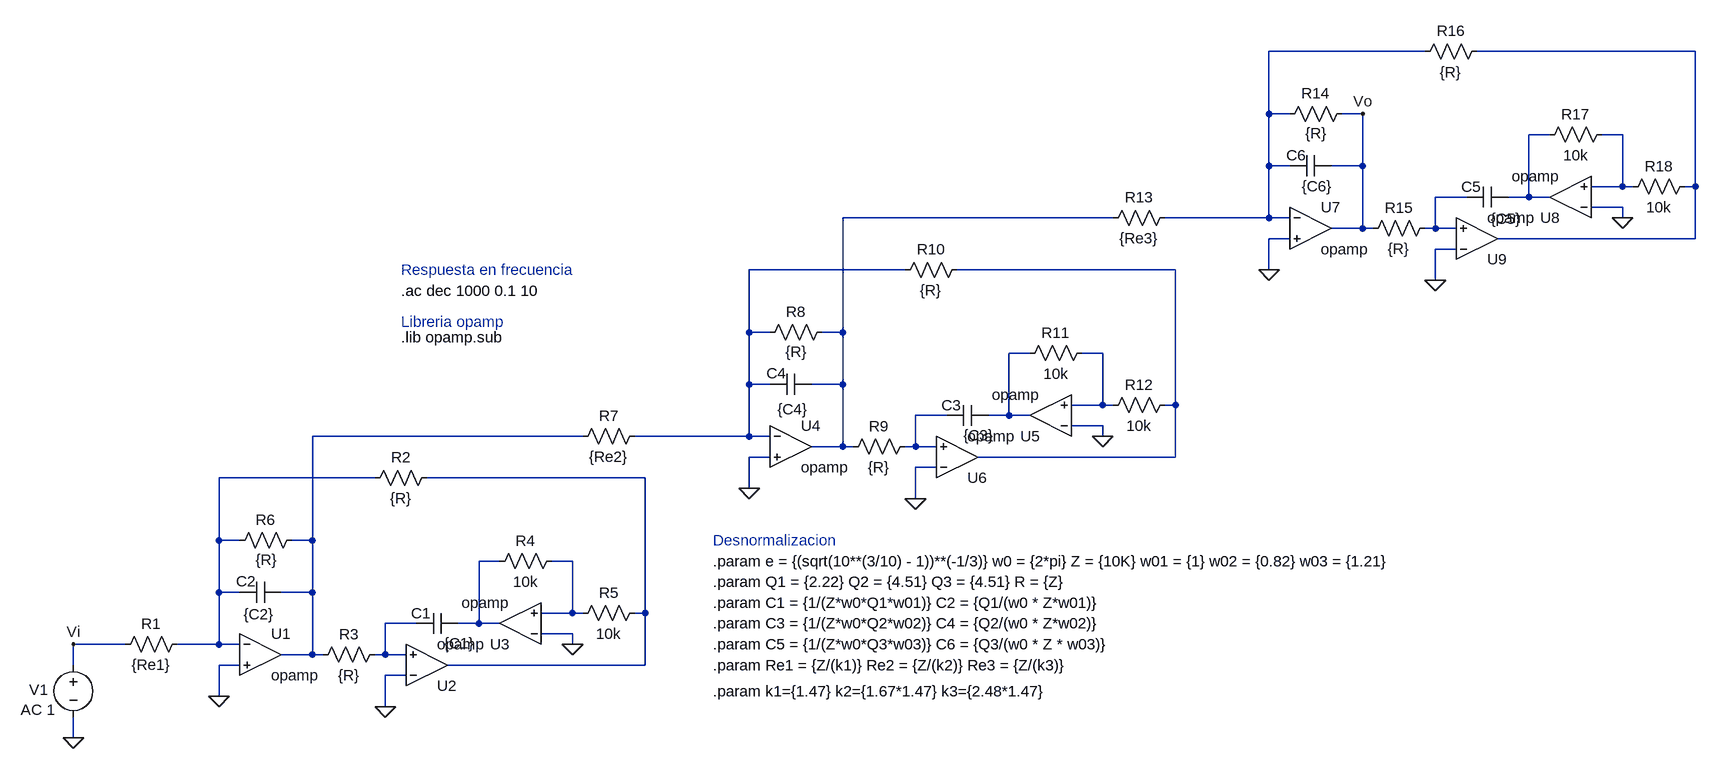
[diagram p0: schematic Circuito_Semana_4bis.asc]
Circuito_Semana_4bis.asc, the LTspice schematic file:
Version 4
SHEET 1 1816 680
WIRE 928 -1072 688 -1072
WIRE 1344 -1072 1008 -1072
WIRE 688 -976 688 -1072
WIRE 720 -976 688 -976
WIRE 832 -976 800 -976
WIRE 1120 -944 1088 -944
WIRE 1232 -944 1200 -944
WIRE 688 -896 688 -976
WIRE 720 -896 688 -896
WIRE 832 -896 832 -976
WIRE 832 -896 784 -896
WIRE 1232 -864 1232 -944
WIRE 1232 -864 1184 -864
WIRE 1248 -864 1232 -864
WIRE 1344 -864 1344 -1072
WIRE 1344 -864 1328 -864
WIRE 992 -848 944 -848
WIRE 1088 -848 1088 -944
WIRE 1088 -848 1056 -848
WIRE 1120 -848 1088 -848
WIRE 1232 -832 1184 -832
WIRE 448 -816 32 -816
WIRE 688 -816 688 -896
WIRE 688 -816 528 -816
WIRE 720 -816 688 -816
WIRE 1232 -816 1232 -832
WIRE 832 -800 832 -896
WIRE 832 -800 784 -800
WIRE 848 -800 832 -800
WIRE 944 -800 944 -848
WIRE 944 -800 928 -800
WIRE 976 -800 944 -800
WIRE 720 -784 688 -784
WIRE 1344 -784 1344 -864
WIRE 1344 -784 1040 -784
WIRE 976 -768 944 -768
WIRE 128 -736 -112 -736
WIRE 544 -736 208 -736
WIRE 688 -736 688 -784
WIRE 944 -720 944 -768
WIRE -112 -640 -112 -736
WIRE -80 -640 -112 -640
WIRE 32 -640 32 -816
WIRE 32 -640 0 -640
WIRE 320 -608 288 -608
WIRE 432 -608 400 -608
WIRE -112 -560 -112 -640
WIRE -80 -560 -112 -560
WIRE 32 -560 32 -640
WIRE 32 -560 -16 -560
WIRE 432 -528 432 -608
WIRE 432 -528 384 -528
WIRE 448 -528 432 -528
WIRE 544 -528 544 -736
WIRE 544 -528 528 -528
WIRE 192 -512 144 -512
WIRE 288 -512 288 -608
WIRE 288 -512 256 -512
WIRE 320 -512 288 -512
WIRE 432 -496 384 -496
WIRE -368 -480 -784 -480
WIRE -112 -480 -112 -560
WIRE -112 -480 -288 -480
WIRE -80 -480 -112 -480
WIRE 432 -480 432 -496
WIRE 32 -464 32 -560
WIRE 32 -464 -16 -464
WIRE 48 -464 32 -464
WIRE 144 -464 144 -512
WIRE 144 -464 128 -464
WIRE 176 -464 144 -464
WIRE -80 -448 -112 -448
WIRE 544 -448 544 -528
WIRE 544 -448 240 -448
WIRE 176 -432 144 -432
WIRE -688 -416 -928 -416
WIRE -272 -416 -608 -416
WIRE -112 -400 -112 -448
WIRE 144 -384 144 -432
WIRE -928 -320 -928 -416
WIRE -896 -320 -928 -320
WIRE -784 -320 -784 -480
WIRE -784 -320 -816 -320
WIRE -496 -288 -528 -288
WIRE -384 -288 -416 -288
WIRE -928 -240 -928 -320
WIRE -896 -240 -928 -240
WIRE -784 -240 -784 -320
WIRE -784 -240 -832 -240
WIRE -384 -208 -384 -288
WIRE -384 -208 -432 -208
WIRE -368 -208 -384 -208
WIRE -272 -208 -272 -416
WIRE -272 -208 -288 -208
WIRE -624 -192 -672 -192
WIRE -528 -192 -528 -288
WIRE -528 -192 -560 -192
WIRE -496 -192 -528 -192
WIRE -384 -176 -432 -176
WIRE -1072 -160 -1152 -160
WIRE -928 -160 -928 -240
WIRE -928 -160 -992 -160
WIRE -896 -160 -928 -160
WIRE -384 -160 -384 -176
WIRE -784 -144 -784 -240
WIRE -784 -144 -832 -144
WIRE -768 -144 -784 -144
WIRE -672 -144 -672 -192
WIRE -672 -144 -688 -144
WIRE -640 -144 -672 -144
WIRE -1152 -128 -1152 -160
WIRE -896 -128 -928 -128
WIRE -272 -128 -272 -208
WIRE -272 -128 -576 -128
WIRE -640 -112 -672 -112
WIRE -928 -80 -928 -128
WIRE -672 -64 -672 -112
WIRE -1152 -16 -1152 -48
FLAG -1152 -16 0
FLAG -1152 -160 Vi
FLAG -928 -80 0
FLAG -672 -64 0
FLAG -384 -160 0
FLAG -112 -400 0
FLAG 144 -384 0
FLAG 432 -480 0
FLAG 688 -736 0
FLAG 944 -720 0
FLAG 1232 -816 0
FLAG 832 -976 Vo
SYMBOL voltage -1152 -144 R0
WINDOW 3 24 44 Left 2
WINDOW 123 -81 85 Left 2
WINDOW 39 0 0 Left 0
WINDOW 0 -68 54 Left 2
SYMATTR Value ""
SYMATTR Value2 AC 1
SYMATTR InstName V1
SYMBOL OpAmps\\opamp -864 -208 R0
SYMATTR InstName U1
SYMBOL res -976 -176 R90
WINDOW 0 0 56 VBottom 2
WINDOW 3 32 56 VTop 2
SYMATTR InstName R1
SYMATTR Value {Re1}
SYMBOL cap -832 -256 R90
WINDOW 0 15 54 VBottom 2
WINDOW 3 34 34 VTop 2
SYMATTR InstName C2
SYMATTR Value {C2}
SYMBOL res -800 -336 R90
WINDOW 0 0 56 VBottom 2
WINDOW 3 30 55 VTop 2
SYMATTR InstName R6
SYMATTR Value {R}
SYMBOL res -592 -432 R90
WINDOW 0 0 56 VBottom 2
WINDOW 3 32 56 VTop 2
SYMATTR InstName R2
SYMATTR Value {R}
SYMBOL OpAmps\\opamp -464 -128 R180
SYMATTR InstName U3
SYMBOL OpAmps\\opamp -608 -64 M180
SYMATTR InstName U2
SYMBOL res -672 -160 R90
WINDOW 0 0 56 VBottom 2
WINDOW 3 32 56 VTop 2
SYMATTR InstName R3
SYMATTR Value {R}
SYMBOL cap -560 -208 R90
WINDOW 0 16 57 VBottom 2
WINDOW 3 31 -2 VTop 2
SYMATTR InstName C1
SYMATTR Value {C1}
SYMBOL res -400 -304 R90
WINDOW 0 0 56 VBottom 2
WINDOW 3 32 56 VTop 2
SYMATTR InstName R4
SYMATTR Value 10k
SYMBOL res -272 -224 R90
WINDOW 0 0 56 VBottom 2
WINDOW 3 32 56 VTop 2
SYMATTR InstName R5
SYMATTR Value 10k
SYMBOL OpAmps\\opamp -48 -528 R0
SYMATTR InstName U4
SYMBOL cap -16 -576 R90
WINDOW 0 15 54 VBottom 2
WINDOW 3 39 29 VTop 2
SYMATTR InstName C4
SYMATTR Value {C4}
SYMBOL res 16 -656 R90
WINDOW 0 0 56 VBottom 2
WINDOW 3 30 55 VTop 2
SYMATTR InstName R8
SYMATTR Value {R}
SYMBOL res 224 -752 R90
WINDOW 0 0 56 VBottom 2
WINDOW 3 32 56 VTop 2
SYMATTR InstName R10
SYMATTR Value {R}
SYMBOL OpAmps\\opamp 352 -448 R180
SYMATTR InstName U5
SYMBOL OpAmps\\opamp 208 -384 M180
SYMATTR InstName U6
SYMBOL res 144 -480 R90
WINDOW 0 0 56 VBottom 2
WINDOW 3 32 56 VTop 2
SYMATTR InstName R9
SYMATTR Value {R}
SYMBOL cap 256 -528 R90
WINDOW 0 16 57 VBottom 2
WINDOW 3 31 15 VTop 2
SYMATTR InstName C3
SYMATTR Value {C3}
SYMBOL res 416 -624 R90
WINDOW 0 0 56 VBottom 2
WINDOW 3 32 56 VTop 2
SYMATTR InstName R11
SYMATTR Value 10k
SYMBOL res 544 -544 R90
WINDOW 0 0 56 VBottom 2
WINDOW 3 32 56 VTop 2
SYMATTR InstName R12
SYMATTR Value 10k
SYMBOL OpAmps\\opamp 752 -864 R0
SYMATTR InstName U7
SYMBOL cap 784 -912 R90
WINDOW 0 15 54 VBottom 2
WINDOW 3 32 22 VTop 2
SYMATTR InstName C6
SYMATTR Value {C6}
SYMBOL res 816 -992 R90
WINDOW 0 0 56 VBottom 2
WINDOW 3 30 55 VTop 2
SYMATTR InstName R14
SYMATTR Value {R}
SYMBOL res 1024 -1088 R90
WINDOW 0 0 56 VBottom 2
WINDOW 3 32 56 VTop 2
SYMATTR InstName R16
SYMATTR Value {R}
SYMBOL OpAmps\\opamp 1152 -784 R180
SYMATTR InstName U8
SYMBOL OpAmps\\opamp 1008 -720 M180
SYMATTR InstName U9
SYMBOL res 944 -816 R90
WINDOW 0 0 56 VBottom 2
WINDOW 3 32 56 VTop 2
SYMATTR InstName R15
SYMATTR Value {R}
SYMBOL cap 1056 -864 R90
WINDOW 0 16 57 VBottom 2
WINDOW 3 34 3 VTop 2
SYMATTR InstName C5
SYMATTR Value {C5}
SYMBOL res 1216 -960 R90
WINDOW 0 0 56 VBottom 2
WINDOW 3 32 56 VTop 2
SYMATTR InstName R17
SYMATTR Value 10k
SYMBOL res 1344 -880 R90
WINDOW 0 0 56 VBottom 2
WINDOW 3 32 56 VTop 2
SYMATTR InstName R18
SYMATTR Value 10k
SYMBOL res -272 -496 R90
WINDOW 0 0 56 VBottom 2
WINDOW 3 32 56 VTop 2
SYMATTR InstName R7
SYMATTR Value {Re2}
SYMBOL res 544 -832 R90
WINDOW 0 0 56 VBottom 2
WINDOW 3 32 56 VTop 2
SYMATTR InstName R13
SYMATTR Value {Re3}
TEXT -648 -704 Left 2 !.ac dec 1000 0.1 10
TEXT -648 -632 Left 2 !.lib opamp.sub
TEXT -648 -736 Left 2 ;Respuesta en frecuencia
TEXT -648 -656 Left 2 ;Libreria opamp
TEXT -168 -320 Left 2 ;Desnormalizacion
TEXT -168 -288 Left 2 !.param e = {(sqrt(10**(3/10) - 1))**(-1/3)} w0 = {2*pi} Z = {10K} w01 = {1} w02 = {0.82} w03 = {1.21}
TEXT -168 -224 Left 2 !.param C1 = {1/(Z*w0*Q1*w01)} C2 = {Q1/(w0 * Z*w01)}
TEXT -168 -256 Left 2 !.param Q1 = {2.22} Q2 = {4.51} Q3 = {4.51} R = {Z}
TEXT -168 -192 Left 2 !.param C3 = {1/(Z*w0*Q2*w02)} C4 = {Q2/(w0 * Z*w02)}
TEXT -168 -160 Left 2 !.param C5 = {1/(Z*w0*Q3*w03)} C6 = {Q3/(w0 * Z * w03)}
TEXT -168 -128 Left 2 !.param Re1 = {Z/(k1)} Re2 = {Z/(k2)} Re3 = {Z/(k3)}
TEXT -168 -88 Left 2 !.param k1={1.47} k2={1.67*1.47} k3={2.48*1.47}

The netlist it stands for:
* Circuito_Semana_4bis.asc
V1 Vi 0 AC 1
XU1 N013 0 N012 opamp Aol=100K GBW=10Meg  ; pins invin noninvin out
R1 N013 Vi {Re1}
C2 N012 N013 {C2}
R6 N012 N013 {R}
R2 N014 N013 {R}
XU3 0 N016 N015 opamp Aol=100K GBW=10Meg  ; pins invin noninvin out
XU2 0 N017 N014 opamp Aol=100K GBW=10Meg  ; pins invin noninvin out
R3 N017 N012 {R}
C1 N015 N017 {C1}
R4 N016 N015 10k
R5 N014 N016 10k
XU4 N007 0 N006 opamp Aol=100K GBW=10Meg  ; pins invin noninvin out
C4 N006 N007 {C4}
R8 N006 N007 {R}
R10 N008 N007 {R}
XU5 0 N010 N009 opamp Aol=100K GBW=10Meg  ; pins invin noninvin out
XU6 0 N011 N008 opamp Aol=100K GBW=10Meg  ; pins invin noninvin out
R9 N011 N006 {R}
C3 N009 N011 {C3}
R11 N010 N009 10k
R12 N008 N010 10k
XU7 N001 0 Vo opamp Aol=100K GBW=10Meg  ; pins invin noninvin out
C6 Vo N001 {C6}
R14 Vo N001 {R}
R16 N002 N001 {R}
XU8 0 N004 N003 opamp Aol=100K GBW=10Meg  ; pins invin noninvin out
XU9 0 N005 N002 opamp Aol=100K GBW=10Meg  ; pins invin noninvin out
R15 N005 Vo {R}
C5 N003 N005 {C5}
R17 N004 N003 10k
R18 N002 N004 10k
R7 N007 N012 {Re2}
R13 N001 N006 {Re3}
.ac dec 1000 0.1 10
.lib opamp.sub
* Respuesta en frecuencia
* Libreria opamp
* Desnormalizacion
.param e = {(sqrt(10**(3/10) - 1))**(-1/3)} w0 = {2*pi} Z = {10K} w01 = {1} w02 = {0.82} w03 = {1.21}
.param C1 = {1/(Z*w0*Q1*w01)} C2 = {Q1/(w0 * Z*w01)}
.param Q1 = {2.22} Q2 = {4.51} Q3 = {4.51} R = {Z}
.param C3 = {1/(Z*w0*Q2*w02)} C4 = {Q2/(w0 * Z*w02)}
.param C5 = {1/(Z*w0*Q3*w03)} C6 = {Q3/(w0 * Z * w03)}
.param Re1 = {Z/(k1)} Re2 = {Z/(k2)} Re3 = {Z/(k3)}
.param k1={1.47} k2={1.67*1.47} k3={2.48*1.47}
.backanno
.end